# EAGLE design NESCAT (EAGLE 8.0.1)
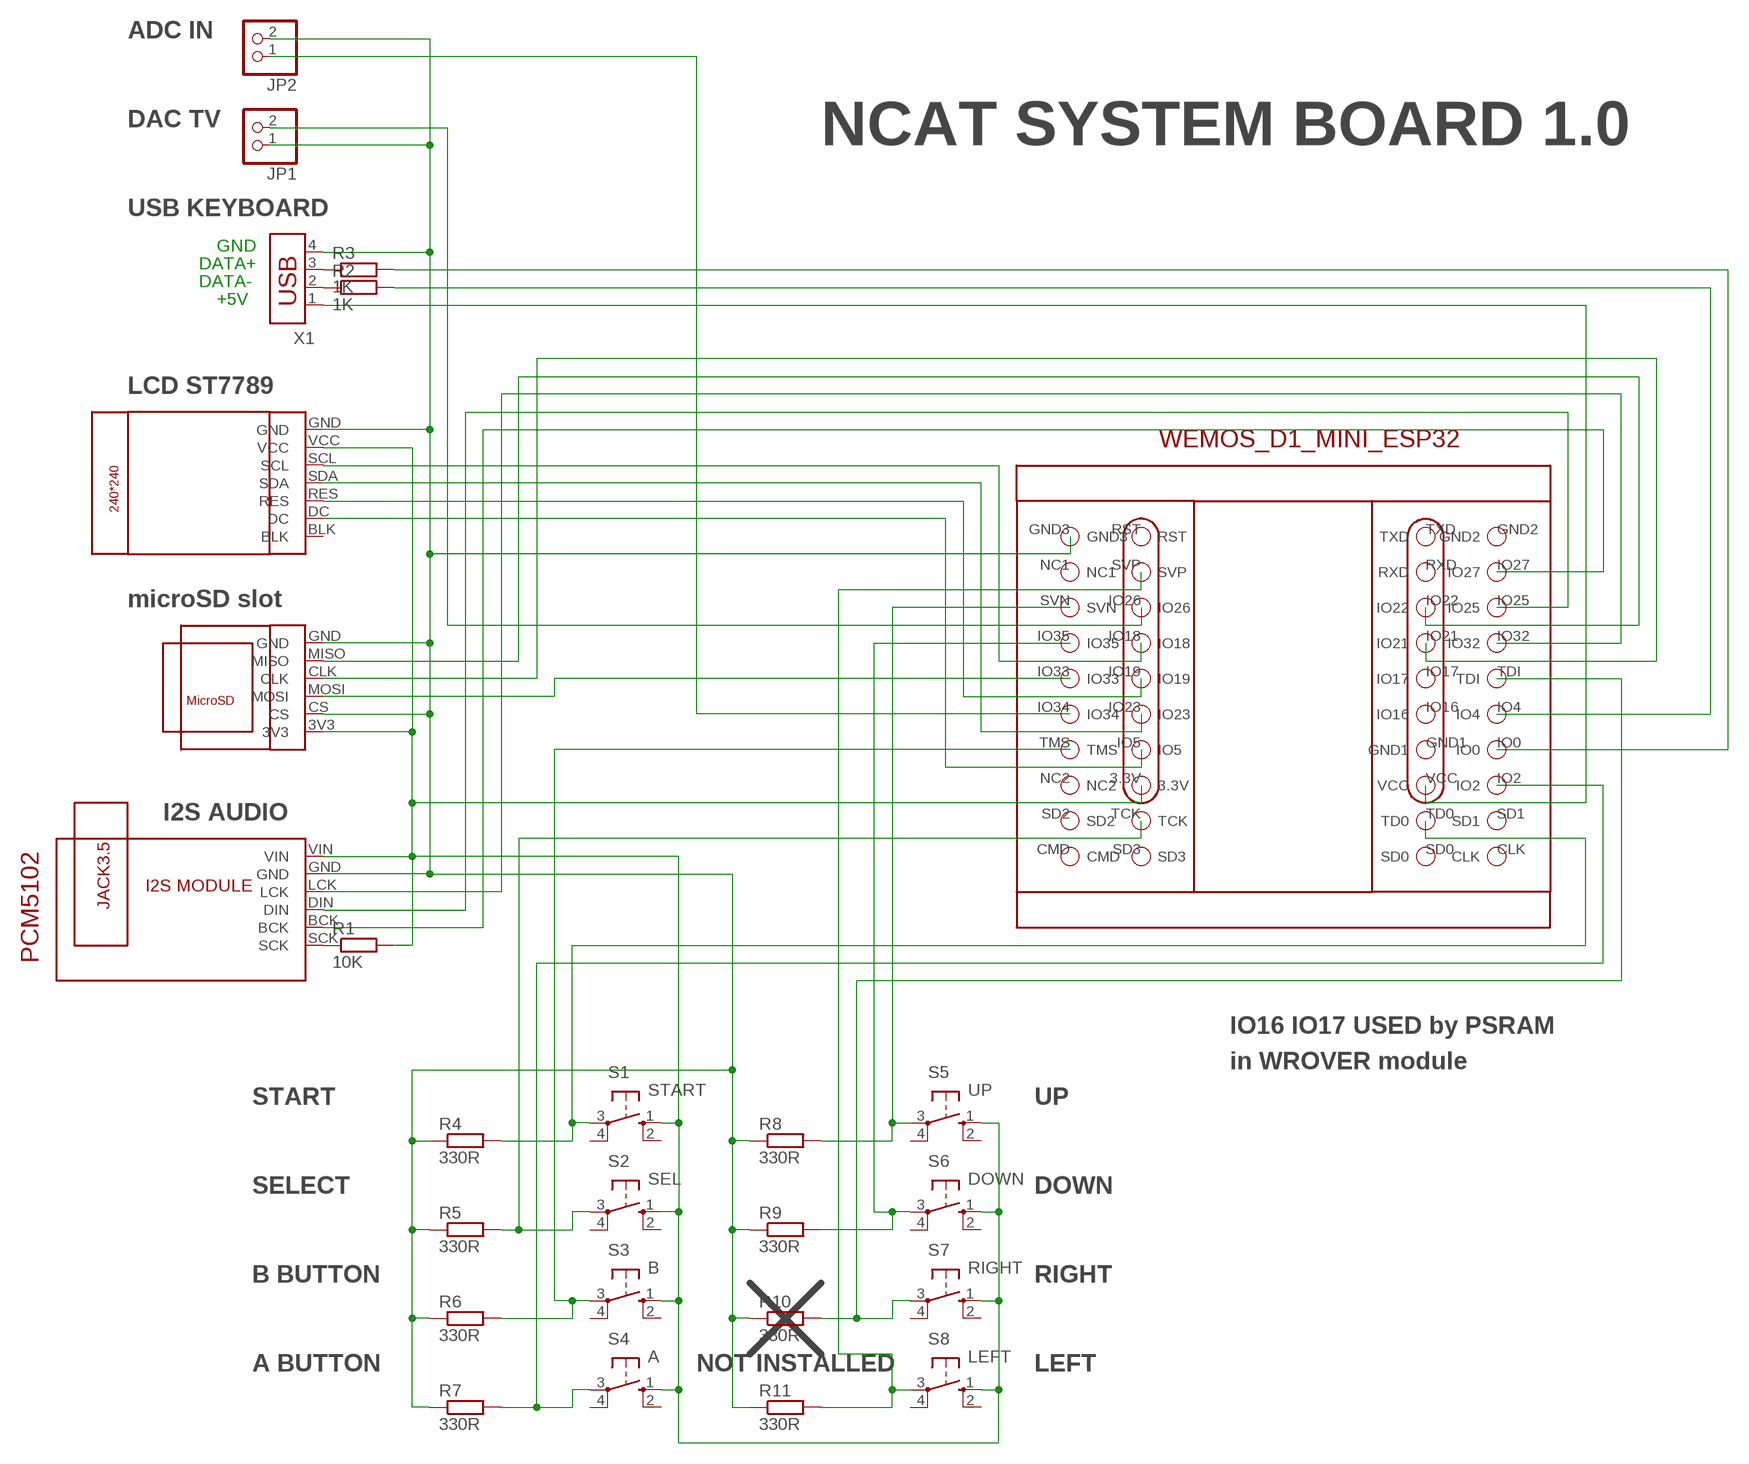
[diagram p0: schematic, sheet 1]

## Parts
JP1  PINHD-1X2/90  [1X02/90]
JP2  PINHD-1X2/90  [1X02/90]
R1  10K  R-RESISTORR-0207/10H  [R-0207/10H]
R2  1K  R-RESISTORR-0207/10H  [R-0207/10H]
R3  1K  R-RESISTORR-0207/10H  [R-0207/10H]
R4  330R  R-RESISTORR-0207/10H  [R-0207/10H]
R5  330R  R-RESISTORR-0207/10H  [R-0207/10H]
R6  330R  R-RESISTORR-0207/10H  [R-0207/10H]
R7  330R  R-RESISTORR-0207/10H  [R-0207/10H]
R8  330R  R-RESISTORR-0207/10H  [R-0207/10H]
R9  330R  R-RESISTORR-0207/10H  [R-0207/10H]
R10  330R  R-RESISTORR-0207/10H  [R-0207/10H]
R11  330R  R-RESISTORR-0207/10H  [R-0207/10H]
S1  START  10-XX  [B3F-10XX]
S2  SEL  10-XX  [B3F-10XX]
S3  B  10-XX  [B3F-10XX]
S4  A  10-XX  [B3F-10XX]
S5  UP  10-XX  [B3F-10XX]
S6  DOWN  10-XX  [B3F-10XX]
S7  RIGHT  10-XX  [B3F-10XX]
S8  LEFT  10-XX  [B3F-10XX]
U$1  WEMOS_D1_MINI_ESP32  [WEMOS_D1_MINI_ESP32]
U$2  ST7789-1.3INCH  [ST7789-1.3INCH]
U$3  MICROSD-CARD-MODULE  [MICROSD-CARD-MODULE]
U$4  I2S-MODULE-PCM5102A-LITE  [I2S-MODULE-PCM5102A-LITE]
X1  USB-787616  [USB]

## Nets
N$3: U$1.IO32 U$4.LCK
N$5: R1.1 U$4.SCK
N$6: JP1.2 U$1.IO26
N$7: R2.1 X1.2
N$8: R3.1 X1.3
N$10: U$1.VCC X1.1
N$12: R7.2 S4.3(P) U$1.IO2
N$13: U$1.IO27 U$4.BCK
N$15: R1.2 S1.1(S) S2.1(S) S3.1(S) S4.1(S) S5.1(S) S6.1(S) S7.1(S) S8.1(S) U$1.3.3V U$2.VCC U$3.3V3 U$4.VIN
N$17: U$1.IO25 U$4.DIN
N$18: U$1.IO18 U$2.SCL
N$19: U$1.IO23 U$2.SDA
N$20: U$1.IO19 U$2.RES
N$21: R8.2 S5.3(P) U$1.SVN
N$22: R5.2 S2.3(P) U$1.TCK
N$24: R6.2 S3.3(P) U$1.TMS
N$46: U$1.IO33 U$3.MOSI
N$63: U$1.IO5 U$2.DC
N$64: U$1.IO22 U$3.MISO
N$65: U$1.IO21 U$3.CLK
N$66: R9.2 S6.3(P) U$1.IO35
N$68: R4.2 S1.3(P) U$1.TD0
N$69: JP2.1 U$1.IO34
N$70: R2.2 U$1.IO4
N$71: R3.2 U$1.IO0
N$72: R11.2 S8.3(P) U$1.SVP
N$73: R10.2 S7.3(P) U$1.TDI
N$77: JP1.1 JP2.2 R4.1 R5.1 R6.1 R7.1 R8.1 R9.1 R10.1 R11.1 U$1.GND3 U$2.GND U$3.CS U$3.GND U$4.GND X1.4
Unconnected: S1.2(S1) S1.4(P1) S2.2(S1) S2.4(P1) S3.2(S1) S3.4(P1) S4.2(S1) S4.4(P1) S5.2(S1) S5.4(P1) S6.2(S1) S6.4(P1) S7.2(S1) S7.4(P1) S8.2(S1) S8.4(P1) U$1.CLK U$1.CMD U$1.GND1 U$1.GND2 U$1.IO16 U$1.IO17 U$1.NC1 U$1.NC2 U$1.RST U$1.RXD U$1.SD0 U$1.SD1 U$1.SD2 U$1.SD3 U$1.TXD U$2.BLK

## Notes on the sheet
- ADC IN
- DAC TV
- NCAT SYSTEM BOARD 1.0
- USB KEYBOARD
- GND
- DATA+
- DATA-
- +5V
- LCD ST7789
- microSD slot
- I2S AUDIO
- IO16 IO17 USED by PSRAM
- in WROVER module
- START | UP
- SELECT | DOWN
- B BUTTON | RIGHT
- A BUTTON | NOT INSTALLED | LEFT

## Library data of the parts
JP1 JP2 = pinhead:PINHD-1X2: PIN HEADER
R1-R11 = NCX-LIB:R-RESISTOR
S1-S8 = switch-omron:10-XX: OMRON SWITCH; MPN: B3F-1000; OC_FARNELL: 176432; OC_NEWARK: 36M3542
U$1 = wemos_D1_mini_ESP32:WEMOS_D1_MINI_ESP32
U$2 = ST7789-1.3INCH:ST7789-1.3INCH
U$3 = MICROSD-CARD-MODULE:MICROSD-CARD-MODULE
U$4 = I2S-MODULE-PCM5102A:I2S-MODULE-PCM5102A-LITE
X1 = con-amp:USB-787616: AMP connector

## Board
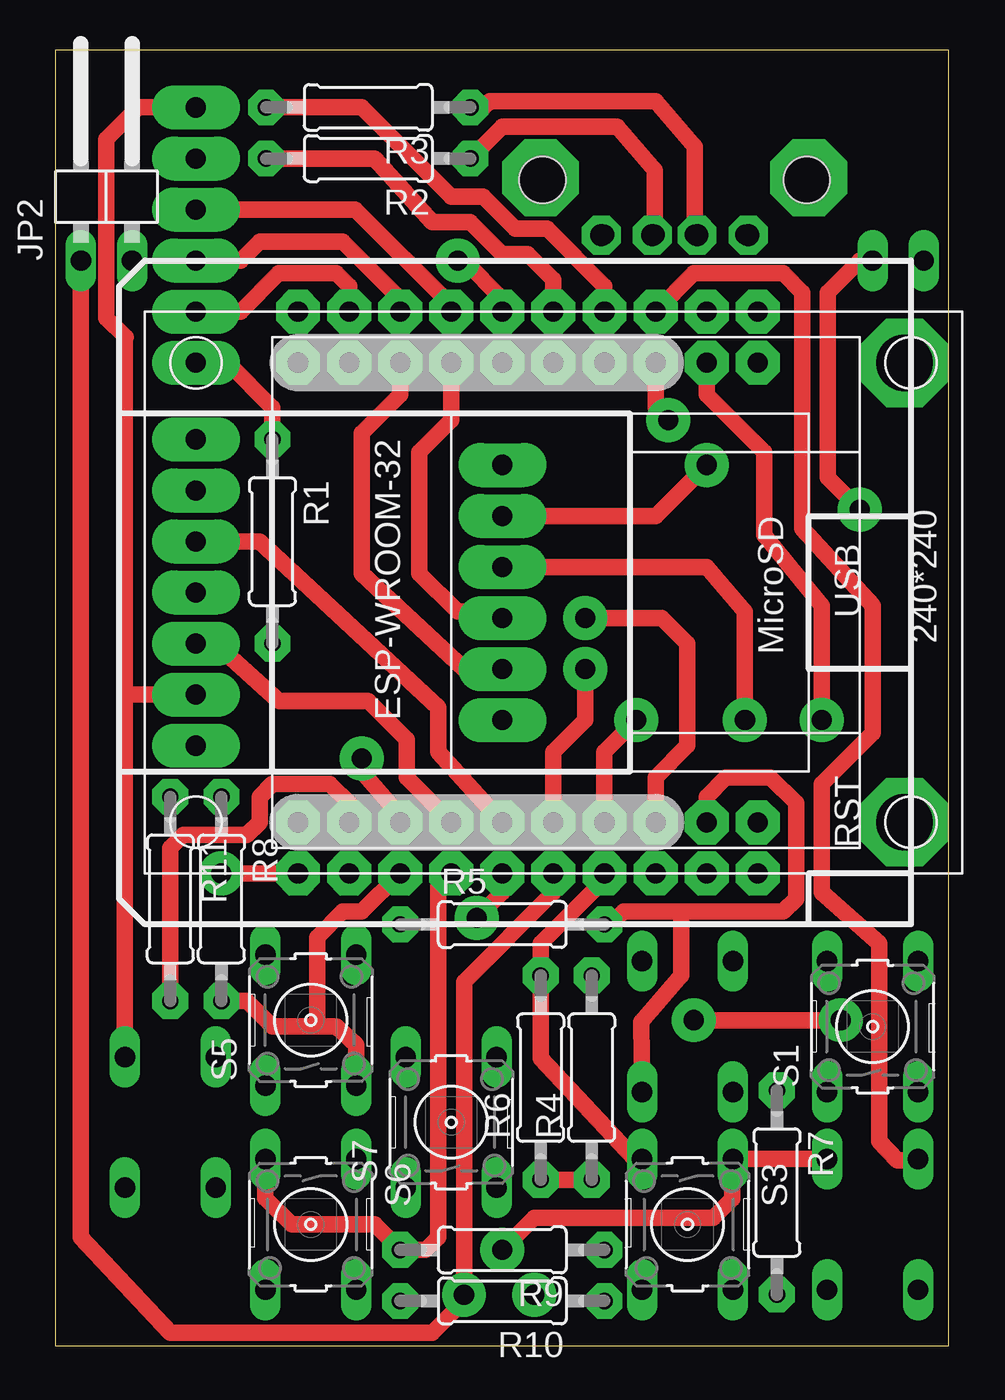
[diagram p1: board, top side]
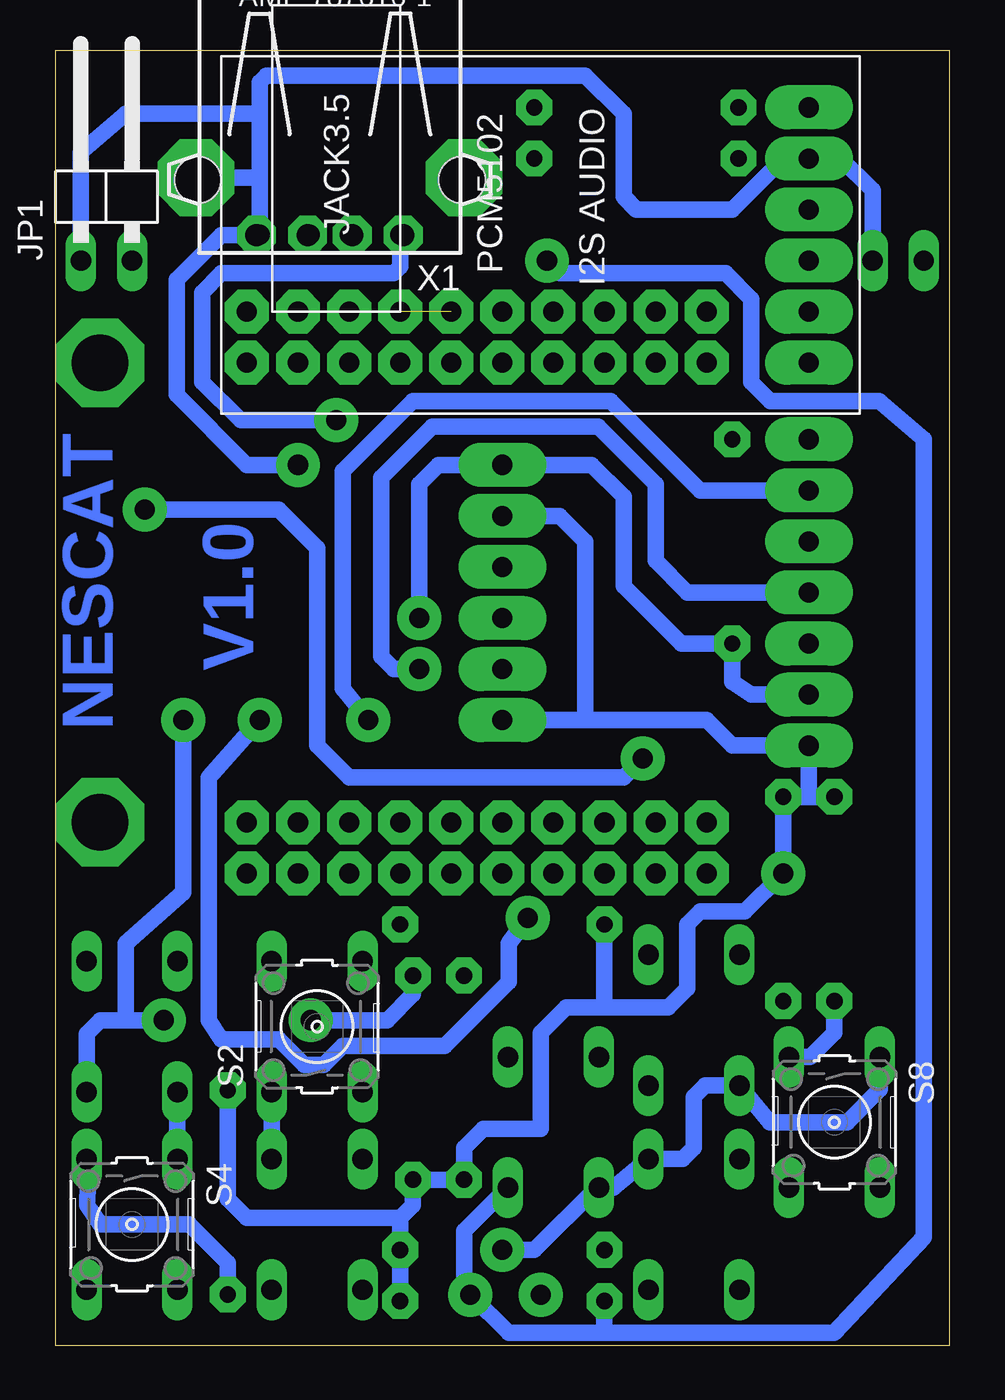
[diagram p2: board, bottom side, seen from below]

Size 44.43 x 64.44 mm. Coordinates in mm from the lower left corner, seen from the top.
Outline: 0,0 44.43,0 44.43,64.44 0,64.44 0,0
Copper layers (1*16): Top 0.035mm / dielectric 1.5mm / Bottom 0.035mm
Design rules "default": minimum track width 10mil, minimum drill 24mil, track to track 8mil, track to pad 8mil, pad to pad 8mil, via to via 8mil, smd to smd 8mil, copper to edge 40mil, drill to drill 8mil, minimum pad ring 10mil, minimum via ring 8mil, stop-mask expansion 4mil, vias tented up to drill 0mil, thermal gap 10mil

### Footprints (pad centres in the part's own frame; a part is rotated, then mirrored left to right if it is on the bottom)
1X02/90 = drill 1.016 long: 1 -1.27,-3.81; 2 1.27,-3.81
R-0207/10H = drill 0.813 pad 1.778 octagon: 1 -5.08,0; 2 5.08,0
B3F-10XX = drill 1.016 long: 1 -3.251,2.261; 2 3.251,2.261; 3 -3.251,-2.261; 4 3.251,-2.261
WEMOS_D1_MINI_ESP32 = drill 1 pad 1.676 octagon: 3.3V -11.43,-10.16; CLK 13.97,-15.24; CMD -13.97,-15.24; GND1 11.43,-7.62; GND2 13.97,7.62; GND3 -13.97,7.62; IO0 13.97,-7.62; IO2 13.97,-10.16; IO4 13.97,-5.08; IO5 -11.43,-7.62; IO16 11.43,-5.08; IO17 11.43,-2.54; IO18 -11.43,0; IO19 -11.43,-2.54; IO21 11.43,0; IO22 11.43,2.54; IO23 -11.43,-5.08; IO25 13.97,2.54; IO26 -11.43,2.54; IO27 13.97,5.08; IO32 13.97,0; IO33 -13.97,-2.54; IO34 -13.97,-5.08; IO35 -13.97,0; NC1 -13.97,5.08; NC2 -13.97,-10.16; RST -11.43,7.62; RXD 11.43,5.08; SD0 11.43,-15.24; SD1 13.97,-12.7; SD2 -13.97,-12.7; SD3 -11.43,-15.24; SVN -13.97,2.54; SVP -11.43,5.08; TCK -11.43,-12.7; TD0 11.43,-12.7; TDI 13.97,-2.54; TMS -13.97,-7.62; TXD 11.43,7.62; VCC 11.43,-10.16
ST7789-1.3INCH = drill 1 pad 2.184 long: BLK -7.62,-19.05; DC -5.08,-19.05; GND 7.62,-19.05; RES -2.54,-19.05; SCL 2.54,-19.05; SDA 0,-19.05; VCC 5.08,-19.05
MICROSD-CARD-MODULE = drill 1 pad 2.184 long: 3V3 -6.35,-10.16; CLK 1.27,-10.16; CS -3.81,-10.16; GND 6.35,-10.16; MISO 3.81,-10.16; MOSI -1.27,-10.16
I2S-MODULE-PCM5102A-LITE = drill 1 pad 2.184 long: BCK -3.81,-13.335; DIN -1.27,-13.335; GND 3.81,-13.335; LCK 1.27,-13.335; SCK -6.35,-13.335; VIN 6.35,-13.335
USB = drill 1: 1 -3.5,12.99; 2 -1,12.99; 3 1,12.99; 4 3.5,12.99 | hole 2.3: -6.57,10.28; 6.57,10.28

### Placement (x,y rotation side)
JP1  41.91,57.78 0 bottom
JP2  2.54,57.78 0 top
R1  10.79,40.01 270 top
R2  15.56,59.05 180 top
R3  15.56,61.59 180 top
R4  26.67,13.34 90 top
R5  22.23,20.95 0 top
R6  24.13,13.34 90 top
R7  35.88,7.62 270 top
R8  8.26,22.23 270 top
R9  22.23,4.76 180 top
R10  22.23,2.22 180 top
R11  5.71,22.23 270 top
S1  40.64,15.88 90 top
S2  31.43,15.88 90 bottom
S3  31.43,6.03 270 top
S4  40.64,6.03 270 bottom
S5  12.7,16.19 90 top
S6  12.7,6.03 270 top
S7  19.68,11.11 90 top
S8  5.71,11.11 270 bottom
U$1  19.68,37.47 90 top
U$2  26.04,37.47 270 top
U$3  32.38,37.47 270 top
U$4  20.32,55.24 90 bottom
X1  30.8,68.26 180 bottom

### Tracks (layer width: path | path; a pad name or v marks a point on that pad's centre or on a via)
N$1  (via drill 2 pad 3.81)
  Bottom 0.813: 34.29,58.1 v37.47,58.1
N$2  (via drill 1.1 pad 1.93)
  other vias: 27.15,55.24
N$3
  Top 0.813: U$1.IO32 19.68,51.75 14.92,56.52 U$4.LCK
N$4  (via drill 1.1 pad 1.93)
  other vias: 29.69,55.24
N$5
  Top 0.813: U$4.SCK 8.57,48.9 10.79,46.67 R1.1
N$6  (via drill 1 pad 2.18)
  Top 0.813: JP1.2 40.01,53.98 38.42,52.39 38.42,43.18 v40.01,41.59 | v15.24,29.21 15.24,28.57 17.14,26.35 U$1.IO26
  Bottom 0.813: v40.01,41.59 33.34,41.59 31.43,39.69 31.43,29.84 29.84,28.26 16.19,28.26 v15.24,29.21
N$7
  Top 0.813: R2.1 22.23,60.64 27.94,60.64 29.8,58.47 X1.2
N$8
  Top 0.813: R3.1 21.27,61.59 21.59,61.91 29.84,61.91 31.8,59.64 X1.3
N$9  (via drill 1.1 pad 1.93)
  other vias: 31.91,55.24
N$10  (via drill 1 pad 2.18)
  Top 0.813: v30.48,46.04 29.84,46.67 U$1.VCC
  Bottom 0.813: X1.1 27.3,53.66 27.62,53.34 36.2,53.34 37.15,52.39 37.15,47.94 35.24,46.04 v30.48,46.04
N$11  (via drill 1 pad 2.18)
  other vias: 32.38,26.04
N$12
  Top 0.813: U$1.IO2 31.75,53.34 36.2,53.34 37.15,52.39 37.15,40.64 40.64,36.83 40.64,30.48 38.1,27.94 38.1,22.54 40.96,20 40.96,10.16 41.87,9.21 42.82,9.21 S4.3
  Bottom 0.813: R7.2 35.88,4.13 37.78,6.03 42.23,6.03 42.86,6.99 42.82,9.21 S4.3
N$13
  Top 0.813: U$1.IO27 14.61,52.7 13.97,53.34 11.11,53.34 9.21,51.44 U$4.BCK
N$14  (via drill 1 pad 2.18)
  other vias: 34.92,23.5
N$15  (via drill 1 pad 2.18)
  Top 0.813: U$1.3.3V 29.84,28.26 31.43,29.84 31.43,34.92 30.16,36.2 v26.35,36.2 | v22.23,4.76 23.81,6.35 32.7,6.35 33.66,7.3 33.66,9.25 S3.1 S4.1 | U$4.VIN 4.13,61.59 2.54,60.01 2.54,51.12 3.49,50.16 3.45,50.13 3.45,32.38 | 3.45,32.38 S8.1 | U$2.VCC 3.45,32.38
  Bottom 0.813: U$2.VCC 9.84,32.38 10.79,33.02 R1.2 13.34,34.92 16.19,37.78 16.19,42.23 17.78,43.81 U$3.3V3 25.4,43.81 26.35,42.86 v26.35,36.2 | S7.1 16.7,7.86 S6.1 13.26,9.28 12.7,9.84 12.7,12.38 12.14,12.94 S5.1 8.93,11.11 5.08,11.11 3.45,12.74 S8.1 | S7.1 17.74,7.66 | 38.3,9.21 S4.1 S1.1 | 33.77,9.21 S3.1 S2.1 | S7.1 17.54,7.86 20.64,4.76 v22.23,4.76
N$16  (via drill 1 pad 2.18)
  other vias: 34.92,26.04
N$17
  Top 0.813: 6.67,53.98 U$4.DIN 9.21,53.98 10.16,54.93 14.29,54.93 17.14,52.07 U$1.IO25
N$18
  Top 0.813: U$1.IO18 17.46,28.26 17.46,30.16 15.56,32.07 11.11,32.07 7.94,34.92 U$2.SCL
N$19  (via drill 1 pad 2.18)
  Top 0.813: v26.35,33.66 26.35,31.11 24.77,29.53 U$1.IO23
  Bottom 0.813: U$2.SDA 13.02,37.47 14.61,39.05 14.61,42.86 17.46,45.72 25.72,45.72 28.26,43.18 28.26,34.29 27.62,33.66 v26.35,33.66
N$20
  Top 0.813: U$2.RES 10.16,40.01 19.05,31.75 19.05,29.53 U$1.IO19
N$21
  Top 0.813: S5.3 14.96,14.96 13.97,15.88 13.02,15.88 | 13.02,15.88 13.02,20.32 14.29,21.59 15.24,21.59 U$1.SVN | R8.2 9.53,17.14 10.79,15.88 13.02,15.88
N$22
  Top 0.813: 31.11,21.59 28.26,21.59 27.3,20.64 R5.2 | 31.11,21.59 36.2,21.59 36.83,22.23 36.83,26.99 35.56,28.26 33.34,28.26 32.38,27.3 U$1.TCK | 31.11,21.59 31.11,18.41 29.13,16.12 S2.3
  Bottom 0.813: R5.2 27.62,20.95
N$23  (via drill 1.1 pad 1.93)
  other vias: 34.45,55.24
N$24
  Top 0.813: S3.3 28.82,9.28 24.13,14.29 R6.2 24.13,20 27.3,23.18 U$1.TMS
N$25  (via drill 1 pad 2.18)
  other vias: 32.38,23.5
N$26  (via drill 1 pad 2.18)
  other vias: 32.38,48.9
N$27  (via drill 1 pad 2.18)
  other vias: 12.06,48.9
N$28  (via drill 1 pad 2.18)
  other vias: 12.06,51.44
N$29  (via drill 1 pad 2.18)
  other vias: 14.61,48.9
N$30  (via drill 1 pad 2.18)
  other vias: 14.61,51.44
N$31  (via drill 1 pad 2.18)
  other vias: 17.14,48.9
N$32  (via drill 1 pad 2.18)
  other vias: 17.14,51.44
N$33  (via drill 1 pad 2.18)
  other vias: 19.68,48.9
N$34  (via drill 1 pad 2.18)
  other vias: 19.68,51.44
N$35  (via drill 1 pad 2.18)
  other vias: 22.23,48.9
N$36  (via drill 1 pad 2.18)
  other vias: 22.23,51.44
N$37  (via drill 1 pad 2.18)
  other vias: 24.77,48.9
N$39  (via drill 1 pad 2.18)
  other vias: 27.3,48.9
N$40  (via drill 1 pad 2.18)  (1 unrouted)
  other vias: 27.3,51.44 24.77,51.44
N$41  (via drill 1 pad 2.18)
  other vias: 29.84,48.9
N$42  (via drill 1 pad 2.18)
  other vias: 29.84,51.44
N$43  (via drill 1 pad 2.18)
  other vias: 34.92,48.9
N$44  (via drill 1 pad 2.18)
  other vias: 34.92,51.44
N$45  (via drill 1 pad 2.18)
  other vias: 32.38,51.44
N$46  (via drill 1 pad 2.18)
  Top 0.813: U$3.MOSI 32.38,38.73 34.29,36.51 v34.29,31.11 | v20.95,21.27 22.23,22.54 U$1.IO33
  Bottom 0.813: v34.29,31.11 36.83,28.26 36.83,16.19 36.2,15.24 33.34,15.24 32.07,13.97 31.11,13.97 30.16,14.92 25.08,14.92 21.91,18.1 21.91,20 v20.95,21.27
N$47  (via drill 1 pad 2.18)
  other vias: 12.06,26.04
N$48  (via drill 1 pad 2.18)
  other vias: 12.06,23.5
N$49  (via drill 1 pad 2.18)
  other vias: 14.61,23.5
N$50  (via drill 1 pad 2.18)
  other vias: 14.61,26.04
N$51  (via drill 1 pad 2.18)
  other vias: 17.14,23.5
N$52  (via drill 1 pad 2.18)
  other vias: 17.14,26.04
N$53  (via drill 1 pad 2.18)
  other vias: 19.68,23.5
N$54  (via drill 1 pad 2.18)
  other vias: 19.68,26.04
N$55  (via drill 1 pad 2.18)
  other vias: 22.23,23.5
N$56  (via drill 1 pad 2.18)
  other vias: 22.23,26.04
N$57  (via drill 1 pad 2.18)
  other vias: 24.77,23.5
N$58  (via drill 1 pad 2.18)
  other vias: 24.77,26.04
N$59  (via drill 1 pad 2.18)
  other vias: 27.3,23.5
N$60  (via drill 1 pad 2.18)
  other vias: 27.3,26.04
N$61  (via drill 1 pad 2.18)
  other vias: 29.84,23.5
N$62  (via drill 1 pad 2.18)
  other vias: 29.84,26.04
N$63  (via drill 1 pad 2.18)
  Top 0.813: v28.89,31.11 27.3,29.53 U$1.IO5
  Bottom 0.813: U$2.DC 12.38,42.55 16.83,46.99 26.67,46.99 30.16,43.5 30.16,32.7 v28.89,31.11
N$64
  Top 0.813: U$1.IO22 17.14,47.31 15.24,45.4 15.24,38.42 20.32,33.66 U$3.MISO
N$65
  Top 0.813: U$1.IO21 19.68,46.04 18.1,44.45 18.1,38.42 20,36.51 21.91,36.51 U$3.CLK
N$66
  Top 0.813: U$1.IO35 19.05,22.86 19.05,5.4 18.41,4.76 R9.2 15.88,6.03 11.75,6.03 10.44,7.34 S6.3
N$68  (via drill 1 pad 2.18)
  Top 0.813: U$1.TD0 32.38,47.31 35.24,44.45 35.24,40.32 38.1,36.83 v38.1,31.11 | v31.75,16.19 v39.05,16.19 38.73,16.19
  Bottom 0.813: v38.1,31.11 38.1,22.54 40.96,20 40.96,16.19 | 40.96,16.19 42.23,16.19 42.9,15.52 S1.3 | R4.2 26.67,17.46 27.94,16.19 v31.75,16.19 | v39.05,16.19 40.96,16.19
N$69  (via drill 1 pad 2.18)
  Top 0.813: U$1.IO34 24.77,22.54 20.32,18.1 v20.32,2.54 20.32,2.22 18.73,0.64 5.71,0.64 1.27,5.4 JP2.1
N$70
  Top 0.813: R2.2 15.88,59.05 18.73,55.88 20.64,55.88 22.23,54.29 23.5,54.29 24.77,53.02 U$1.IO4
N$71
  Top 0.813: R3.2 15.24,61.59 19.68,57.15 21.27,57.15 22.86,55.56 24.45,55.56 27.3,52.7 U$1.IO0
N$72
  Top 0.813: R11.2 5.71,24.77 6.35,25.4 9.53,25.4 10.16,26.04 10.16,27.3 10.79,27.94 13.65,27.94 14.61,26.99 U$1.SVP
  Bottom 0.813: S8.3 6.91,14.36 5.71,15.56 R11.2
N$73  (via drill 1 pad 2.18)
  Top 0.813: v20,53.98 20.32,53.98 22.23,52.07 U$1.TDI
  Bottom 0.813: S7.3 21.98,7.86 24.13,5.71 24.13,2.86 v23.81,2.54 21.91,0.64 17.14,0.64 | 17.14,0.64 5.71,0.64 1.27,5.4 1.27,45.09 3.49,46.99 8.89,46.99 9.84,47.94 9.84,52.07 11.11,53.34 19.37,53.34 v20,53.98 | R10.2 17.14,0.64
N$74  (via drill 2.8 pad 4.4)
  other vias: 42.23,48.9
N$75  (via drill 2.8 pad 4.4)
  other vias: 42.23,26.04
N$76  (via drill 2 pad 3.81)
  other vias: 24.13,58.1
N$77  (via drill 1 pad 2.18)
  Top 0.813: v8.26,23.5 U$1.GND3 | R4.1 R6.1 | U$3.CS 29.84,41.27 v32.38,43.81
  Bottom 0.813: 18.1,31.11 U$3.GND | 18.1,31.11 12.06,31.11 10.79,29.84 U$2.GND 6.99,27.62 6.67,27.3 | R10.1 R9.1 27.3,6.35 | 6.67,27.3 R11.1 | 6.67,27.3 R8.1 v8.26,23.5 10.16,21.59 12.38,21.59 13.02,20.95 13.02,17.78 13.97,16.83 17.14,16.83 | JP1.1 43.18,59.37 40.96,61.28 34.3,61.28 | U$3.CS 19.37,41.27 18.1,40.01 18.1,31.11 | 34.3,61.28 34.3,62.86 33.97,63.18 18.1,63.18 16.19,61.28 16.19,57.15 15.56,56.52 10.79,56.52 8.26,59.05 U$4.GND 5.4,59.05 3.81,57.47 JP2.2 | 34.3,61.28 X1.4 34.33,55.24 36.2,55.24 38.42,53.02 38.42,47.31 34.92,43.81 v32.38,43.81 | R5.1 17.14,16.83 | 27.3,6.35 26.67,6.99 R4.1 R6.1 24.13,9.84 23.18,10.79 20.32,10.79 20.32,15.56 19.05,16.83 17.14,16.83 | R7.1 35.88,7.3 34.92,6.35 27.3,6.35

### Text on the board
Bottom: NESCAT | V1.0